# EAGLE schematic Computer Power Relay - Power Strip - Backup (EAGLE 9.6.2)
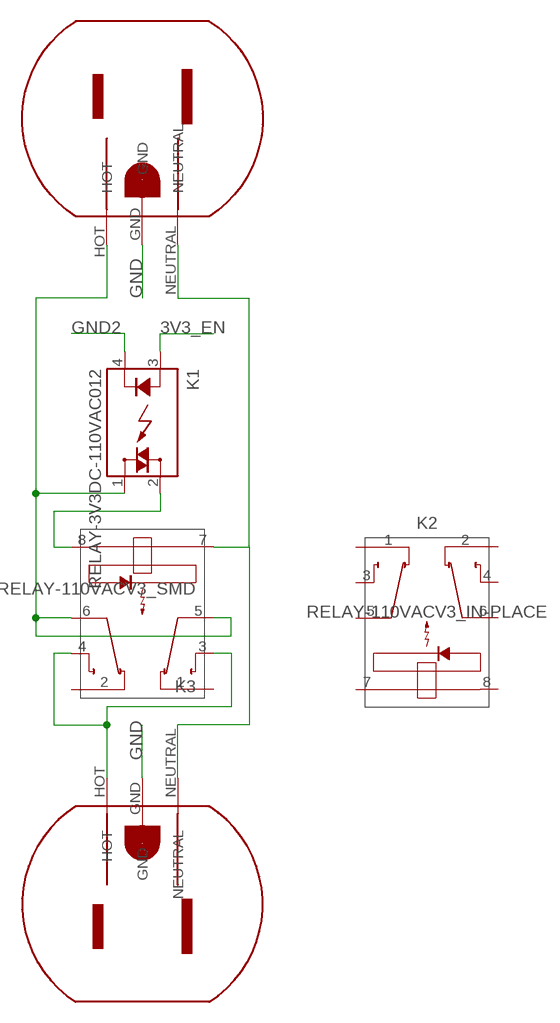
[diagram p0: schematic, sheet 1]

## Parts
K1  RELAY-3V3DC-110VAC012  [RELAY-3V3-110V]
K2  RELAY-110VACV3_IN-PLACE  [RELAY-110VAC-V3]
K3  RELAY-110VACV3_SMD  [RELAY-110VAC-V3-SMD]
U$1  MAINS-POWER-OUTLET3-PIN  [3-PIN-POWER]
U$2  MAINS-POWER-OUTLET3-PIN  [3-PIN-POWER]

## Nets
3V3_EN: K1.3
GND: U$1.GND U$2.GND
GND2: K1.4
N$1: K3.3 K3.4 U$1.HOT
N$11: K1.1 K3.5 K3.6 U$2.HOT
N$12: K3.7 U$1.NEUTRAL U$2.NEUTRAL
N$14: K1.2 K3.8
Unconnected: K2.1 K2.2 K2.3 K2.4 K2.5 K2.6 K2.7 K2.8 K3.1 K3.2

## Library data of the parts
K1 = Inventory:RELAY-3V3DC-110VAC: AUTOMOTIVE LOW PROFILE MICRO-280 RELAY NAiS Source: http://www.mew-europe.com/.. en_ds_61214_0000.pdf; MPN: ACV33012; OC_FARNELL: unknown; OC_NEWARK: 39M3505
K2 K3 = Inventory:RELAY-110VAC: SOLID STATE RELAY NAiS Source: http://www.mew-europe.com/.. en_ds_61606_0000.pdf
U$1 U$2 = Inventory:MAINS-POWER-OUTLET

## Net classes
0 default: clearance 0.205 mm